# Altium project Documents.PrjPcb
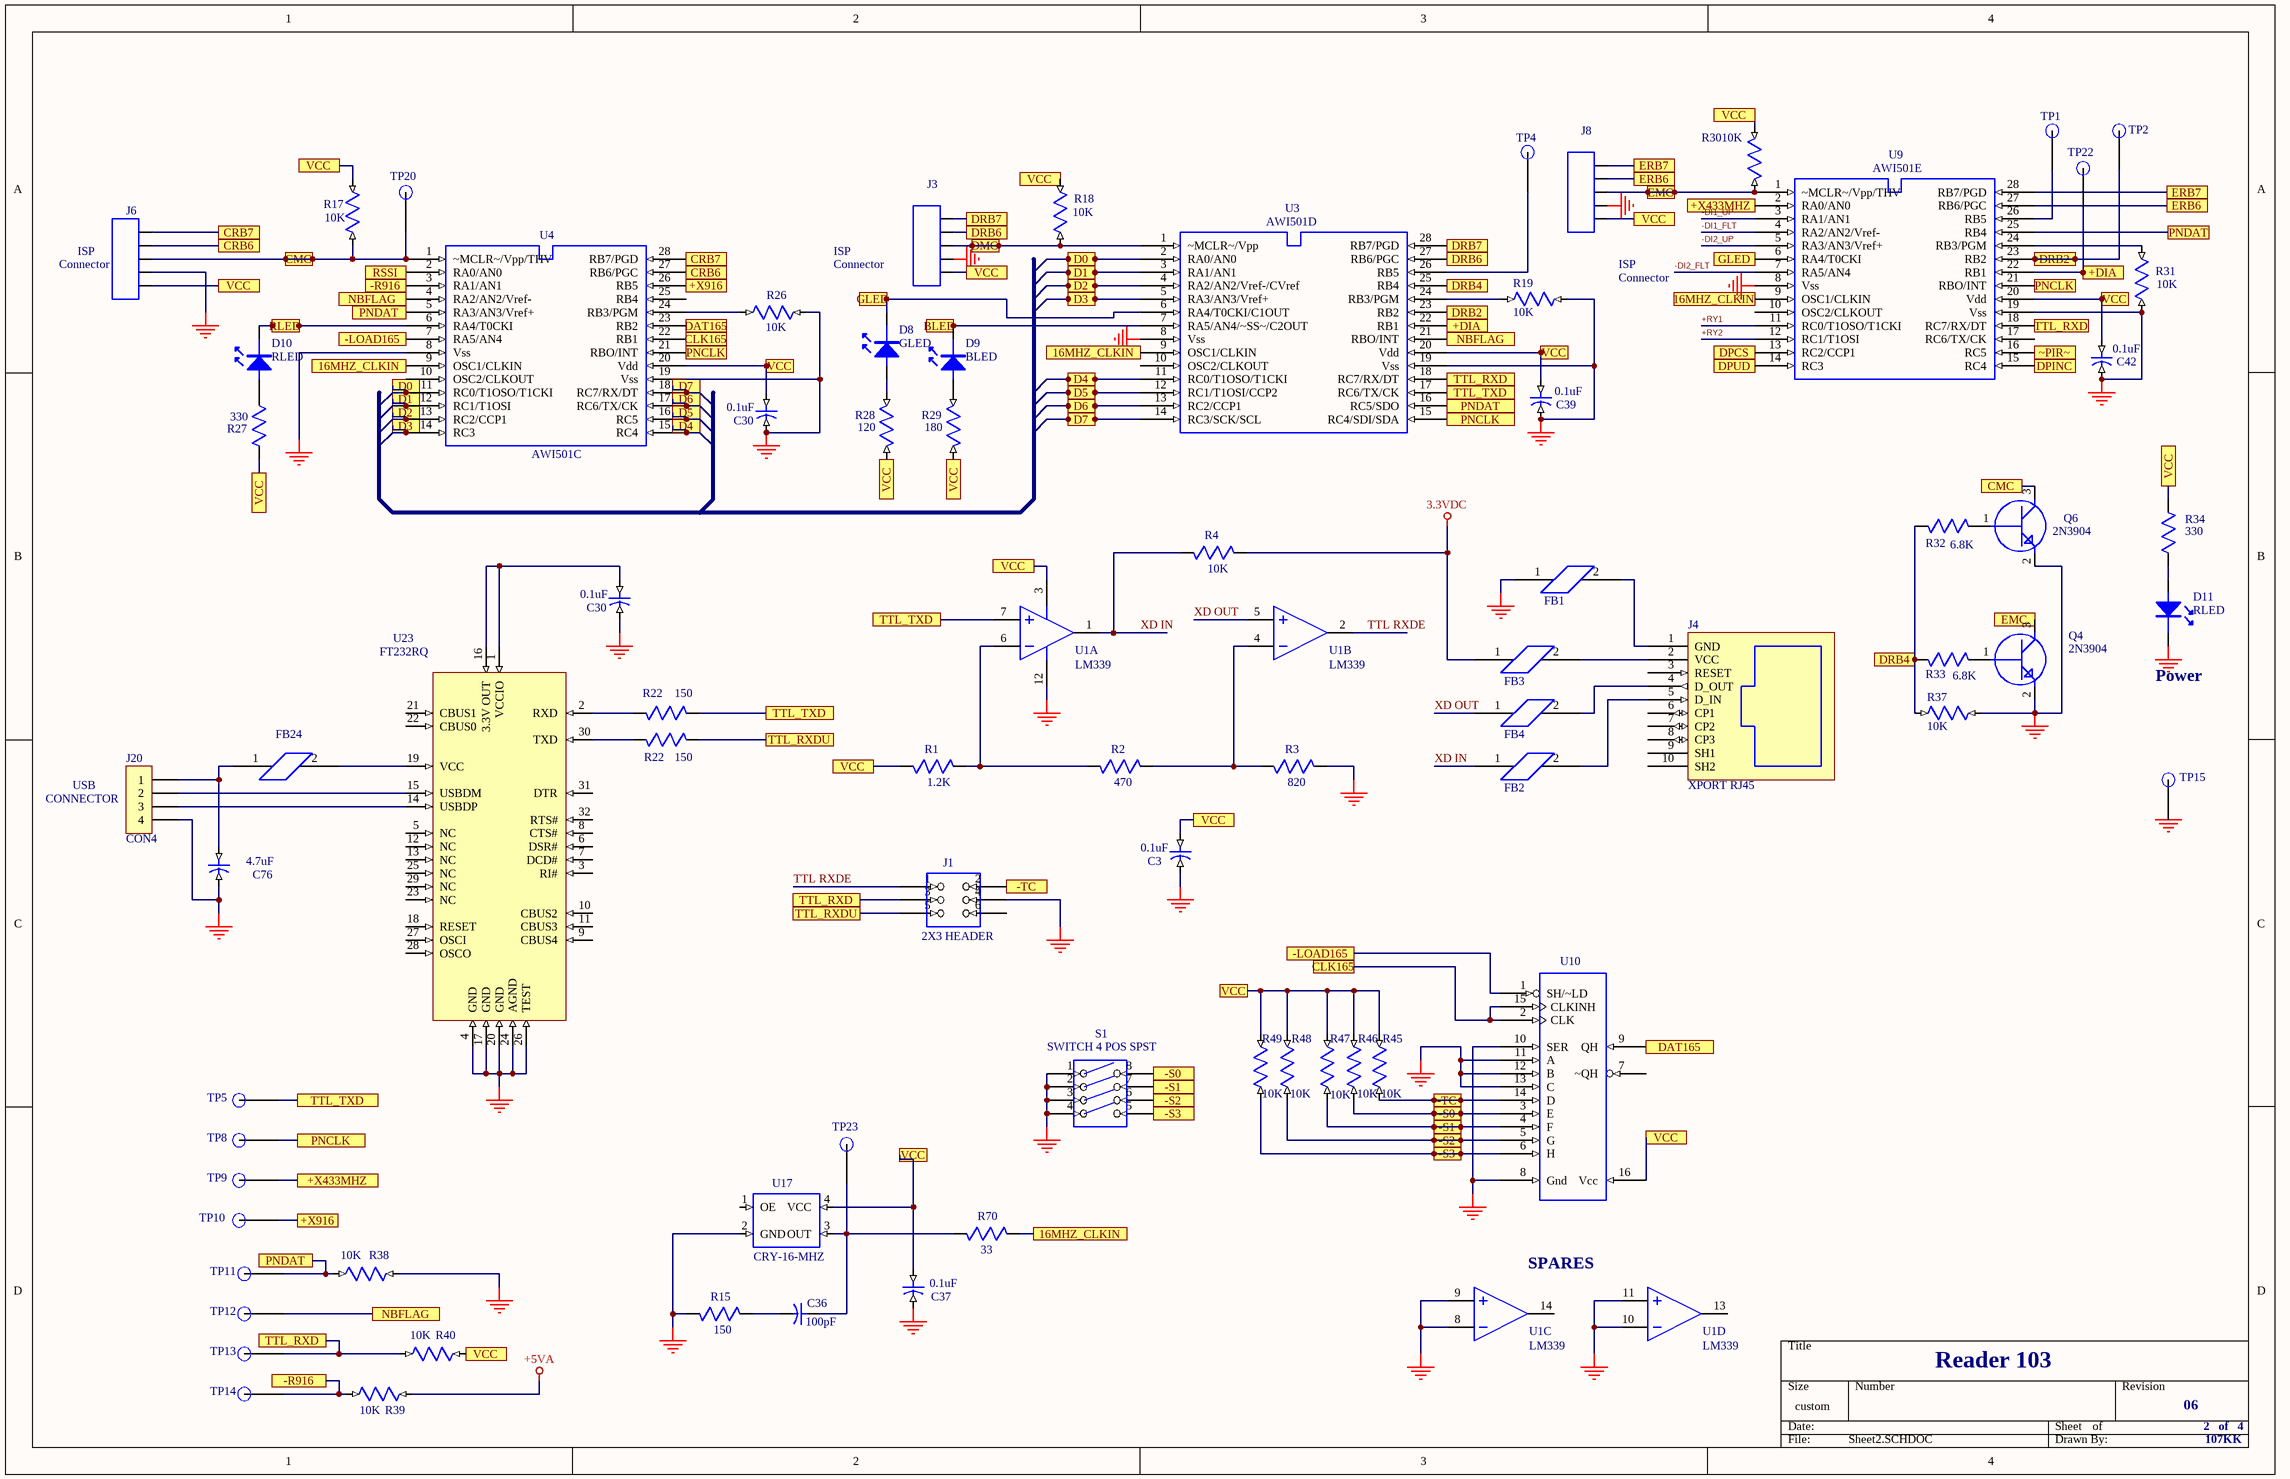
[diagram p0: Sheet2.SCHDOC]
2 sheets, 173 parts. Net scope: flat (ports and power ports of the same name join across sheets).
Sheets:
  Sheet2.SCHDOC
  Sheet3.SCHDOC

## Sheet Sheet2.SCHDOC
size 431 x 279 mm; SheetNumber: 0; SheetTotal: 0

### Parts
(Parts that share a designator on the sheet are numbered #1, #2 ... from top to bottom, then left to right.)
C3  0.1uF  [0603]
C30#1  0.1uF  [0603]
C30#2  0.1uF  [0603]
C36  100pF  [0603]
C37  0.1uF  [0603]
C39  0.1uF  [0603]
C42  0.1uF  [0603]
C76  4.7uF  [0603]
D8  GLED  [LED TH]
D9  BLED  [LED TH]
D10  RLED  [LED TH]
D11  RLED  [LED TH]
FB1  FB  [0603]  (value not drawn)
FB2  FB  [0603]  (value not drawn)
FB3  FB  [0603]  (value not drawn)
FB4  FB  [0603]  (value not drawn)
FB24  FB  [0603]  (value not drawn)
J1  2X3 HEADER  [2X3 HEADER]
J3  HDR5  [1X5 HEADER]  (value not drawn)
J4  XPORT RJ45  [CONN XPORT]
J6  HDR5  [1X5 HEADER]  (value not drawn)
J8  1X5 HEADER  [1X5 HEADER]  (value not drawn)
J20  CON4  [USB JACK]
Q4  2N3904  [SOT23 TRANS]
Q6  2N3904  [SOT23 TRANS]
R1  1.2K  [0603]
R2  470  [0603]
R3  820  [0603]
R4  10K  [0603]
R15  150  [0603]
R17  10K  [0603]
R18  10K  [0603]
R19  10K  [0603]
R22#1  150  [0603]
R22#2  150  [0603]
R26  10K  [0603]
R27  330  [0603]
R28  120  [0603]
R29  180  [0603]
R30  10K  [0603]
R31  10K  [0603]
R32  6.8K  [0603]
R33  6.8K  [0603]
R34  330  [0603]
R37  10K  [0603]
R38  10K  [0603]
R39  10K  [0603]
R40  10K  [0603]
R45  10K  [0603]
R46  10K  [0603]
R47  10K  [0603]
R48  10K  [0603]
R49  10K  [0603]
R70  33  [0603]
S1  SWITCH 4 POS SPST  [SWITCH 4 POS SPST]
TP1  TP  [TESTPOINT-1]  (value not drawn)
TP2  TP  [TESTPOINT-1]  (value not drawn)
TP4  TP  [TESTPOINT-1]  (value not drawn)
TP5  TP  [TESTPOINT-1]  (value not drawn)
TP8  TP  [TESTPOINT-1]  (value not drawn)
TP9  TP  [TESTPOINT-1]  (value not drawn)
TP10  TP  [TESTPOINT-1]  (value not drawn)
TP11  TP  [TESTPOINT-1]  (value not drawn)
TP12  TP  [TESTPOINT-1]  (value not drawn)
TP13  TP  [TESTPOINT-1]  (value not drawn)
TP14  TP  [TESTPOINT-1]  (value not drawn)
TP15  TP  [TESTPOINT-1]  (value not drawn)
TP20  TP  [TESTPOINT-1]  (value not drawn)
TP22  TP  [TESTPOINT-1]  (value not drawn)
TP23  TP  [TESTPOINT-1]  (value not drawn)
U1  LM339  [SO14]  (parts A,B,C,D of 4)
U3  AWI501D  [SSOP-28]
U4  AWI501C  [PIC16F870]
U9  AWI501E  [PIC16F870]
U10  74165  [SO16]  (value not drawn)
U17  CRY-16-MHZ  [CRY-SMD-5-7]
U23  FT232RQ  [QFN32]

### Ports
16MHZ_CLKIN, +DIA, +X433MHZ, +X916, -LOAD165, -R916, -S0, -S1, -S2, -S3, -TC, BLED, CLK165, CMC, CRB6, CRB7, D0, D1, D2, D3, D4, D5, D6, D7, DAT165, DMC, DPCS, DPINC, DPUD, DRB2, DRB4, DRB6, DRB7, EMC, ERB6, ERB7, GLED, NBFLAG, PNCLK, PNDAT, RLED, RSSI, TTL_RXD, TTL_RXDU, TTL_TXD, VCC, ~PIR~

### Nets
3.3VDC: FB3.1 R4.1(A)
+5VA: R39.1(A)
GND_COM: C3.2(B) C30#1.2(B) C30#2.2(B) C37.2(B) C39.2(B) C42.2(B) C76.2(B) D11.K FB1.1 J1.4 J3.4 J6.4 J8.4 J20.4 Q4.2 Q6.2 R3.1(A) R15.2(B) R19.1(A) R26.2(B) R31.2(B) R37.2(B) R38.1(A) S1.1 S1.2 S1.3 S1.4 TP15.1(TP) U1.8 U1.9 U1.10 U1.11 U1.12 U3.8(Vss) U3.19(Vss) U4.8(Vss) U4.19(Vss) U9.8(Vss) U9.19(Vss) U10.8(Gnd) U10.10(SER) U10.11(A) U10.12(B) U10.13(C) U17.2(GND) U23.4(GND) U23.17(GND) U23.20(GND) U23.24(AGND) U23.26(TEST)
+RY1: U9.11(RC0/T1OSO/T1CKI)
+RY2: U9.12(RC1/T1OSI)
-DI1_FLT: U9.4(RA2/AN2/Vref-)
-DI1_UP: U9.3(RA1/AN1)
-DI2_FLT: U9.7(RA5/AN4)
-DI2_UP: U9.5(RA3/AN3/Vref+)
SOUT: R39.2(B) TP14.1(TP) U4.3(RA1/AN1) ; port -R916
TTL RXDE: J1.1 U1.2
XD IN: FB2.1 R4.2(B) U1.1
XD OUT: FB4.1 U1.5
NetC3_1: C3.1(A) C30#1.1(A) C37.1(A) C39.1(A) C42.1(A) J3.5 J6.5 J8.5 R1.2(B) R17.1(A) R18.1(A) R27.1(A) R28.1(A) R29.1(A) R30.1(A) R34.2(B) R40.1(A) R45.2(B) R46.2(B) R47.2(B) R48.2(B) R49.2(B) U1.3 U3.20(Vdd) U4.20(Vdd) U9.20(Vdd) U10.16(Vcc) U17.4(VCC) ; port VCC
NetC30#2_1: C30#2.1(A) U23.1(VCCIO) U23.16(3.3V_OUT)
NetC36_1: C36.1(A) R70.2(B) TP23.1(TP) U17.3(OUT)
NetC36_2: C36.2(B) R15.1(A)
NetC40_1: U9.13(RC2/CCP1) ; port DPCS
NetC43_1: TP9.1(TP) U9.2(RA0/AN0) ; port +X433MHZ
NetC45_1: TP10.1(TP) U4.26(RB5) ; port +X916
NetC47_1: U4.2(RA0/AN0) ; port RSSI
NetC50_1: U9.14(RC3) ; port DPUD
NetC51_1: U9.15(RC4) ; port DPINC
NetC76_1: C76.1(A) FB24.1 J20.1
NetD3_A: U9.16(RC5) ; port ~PIR~
NetD8_A: D8.A R28.2(B)
NetD8_K: D8.K U3.6(RA4/T0CKI/C1OUT) U9.6(RA4/T0CKI) ; port GLED
NetD9_A: D9.A R29.2(B)
NetD9_K: D9.K U3.7(RA5/AN4/~SS~/C2OUT) ; port BLED
NetD10_A: D10.A R27.2(B)
NetD10_K: D10.K U4.6(RA4/T0CKI) ; port RLED
NetD11_A: D11.A R34.1(A)
NetFB1_2: FB1.2 J4.1(GND)
NetFB2_2: FB2.2 J4.5(D_IN)
NetFB3_2: FB3.2 J4.2(VCC)
NetFB4_2: FB4.2 J4.4(D_OUT)
NetFB24_2: FB24.2 U23.19(VCC)
NetJ1_2: J1.2 R45.1(A) U10.14(D) ; port -TC
NetJ1_3: J1.3 R40.2(B) TP13.1(TP) U3.18(RC7/RX/DT) U9.18(RC7/RX/DT) ; port TTL_RXD
NetJ1_5: J1.5 R22#2.1(A) ; port TTL_RXDU
NetJ3_1: J3.1 U3.28(RB7/PGD) ; port DRB7
NetJ3_2: J3.2 U3.27(RB6/PGC) ; port DRB6
NetJ3_3: J3.3 R18.2(B) U3.1(~MCLR~/Vpp) ; port DMC
NetJ6_1: J6.1 U4.28(RB7/PGD) ; port CRB7
NetJ6_2: J6.2 U4.27(RB6/PGC) ; port CRB6
NetJ6_3: J6.3 Q6.3 R17.2(B) TP20.1(TP) U4.1(~MCLR~/Vpp/THV) ; port CMC
NetJ8_1: J8.1 U9.28(RB7/PGD) ; port ERB7
NetJ8_2: J8.2 U9.27(RB6/PGC) ; port ERB6
NetJ8_3: J8.3 Q4.3 R30.2(B) U9.1(~MCLR~/Vpp/THV) ; port EMC
NetJ20_2: J20.2 U23.15(USBDM)
NetJ20_3: J20.3 U23.14(USBDP)
NetQ4_1: Q4.1 R33.2(B)
NetQ6_1: Q6.1 R32.2(B)
NetR1_1: R1.1(A) R2.2(B) U1.6
NetR2_1: R2.1(A) R3.2(B) U1.4
NetR19_2: R19.2(B) U3.24(RB3/PGM)
NetR22#1_1: R22#1.1(A) TP5.1(TP) U1.7 U3.17(RC6/TX/CK) ; port TTL_TXD
NetR22#1_2: R22#1.2(B) U23.2(RXD)
NetR22#2_2: R22#2.2(B) U23.30(TXD)
NetR26_1: R26.1(A) U4.24(RB3/PGM)
NetR31_1: R31.1(A) U9.24(RB3/PGM)
NetR32_1: R32.1(A) R33.1(A) R37.1(A) U3.25(RB4) ; port DRB4
NetR38_2: R38.2(B) TP11.1(TP) U3.16(RC5/SDO) U4.5(RA3/AN3/Vref+) U9.25(RB4) ; port PNDAT
NetR46_1: R46.1(A) S1.8 U10.3(E) ; port -S0
NetR47_1: R47.1(A) S1.7 U10.4(F) ; port -S1
NetR48_1: R48.1(A) S1.6 U10.5(G) ; port -S2
NetR49_1: R49.1(A) S1.5 U10.6(H) ; port -S3
NetR70_1: R70.1(A) U3.9(OSC1/CLKIN) U4.9(OSC1/CLKIN) U9.9(OSC1/CLKIN) ; port 16MHZ_CLKIN
NetTP1_1: TP1.1(TP) U9.26(RB5)
NetTP2_1: TP2.1(TP) U3.23(RB2) U9.23(RB2) ; port DRB2
NetTP4_1: TP4.1(TP) U3.26(RB5)
NetTP8_1: TP8.1(TP) U3.15(RC4/SDI/SDA) U4.21(RBO/INT) U9.21(RBO/INT) ; port PNCLK
NetTP12_1: TP12.1(TP) U3.21(RBO/INT) U4.4(RA2/AN2/Vref-) ; port NBFLAG
NetTP22_1: TP22.1(TP) U3.22(RB1) U9.22(RB1) ; port +DIA
NetU3_2: U3.2(RA0/AN0) U4.11(RC0/T1OSO/T1CKI) ; port D0
NetU3_3: U3.3(RA1/AN1) U4.12(RC1/T1OSI) ; port D1
NetU3_4: U3.4(RA2/AN2/Vref-/CVref) U4.13(RC2/CCP1) ; port D2
NetU3_5: U3.5(RA3/AN3/Vref+) U4.14(RC3) ; port D3
NetU3_11: U3.11(RC0/T1OSO/T1CKI) U4.15(RC4) ; port D4
NetU3_12: U3.12(RC1/T1OSI/CCP2) U4.16(RC5) ; port D5
NetU3_13: U3.13(RC2/CCP1) U4.17(RC6/TX/CK) ; port D6
NetU3_14: U3.14(RC3/SCK/SCL) U4.18(RC7/RX/DT) ; port D7
NetU4_7: U4.7(RA5/AN4) U10.1(SH/~LD) ; port -LOAD165
NetU4_22: U4.22(RB1) U10.2(CLK) U10.15(CLKINH) ; port CLK165
NetU4_23: U4.23(RB2) U10.9(QH) ; port DAT165

Not connected (* = marked no-connect by the designer): J1 6; J4 3(RESET) 6(CP1) 7(CP2) 8(CP3) 9(SH1) 10(SH2); U1 13 14; U3 10(OSC2/CLKOUT); U4 10(OSC2/CLKOUT) 25(RB4); U9 10(OSC2/CLKOUT) 17(RC6/TX/CK); U10 7(~QH); U17 1(OE); U23 3(RI#) 5(NC) 6(DSR#) 7(DCD#) 8(CTS#) 9(CBUS4) 10(CBUS2) 11(CBUS3) 12(NC) 13(NC) 18(RESET) 21(CBUS1) 22(CBUS0) 23(NC) 25(NC) 27(OSCI) 28(OSCO) 29(NC) 31(DTR) 32(RTS#)

### Notes on the sheet
- (near J6) Connector
- (near J6) ISP
- ISP
- Connector
- (near D11) Power
- (near J20) CONNECTOR
- USB
- (near U1) SPARES
- Reader 103
- 06
- 2   of   4
- 107KK

### Library data of the parts
C3 C30#1 C30#2 C37 C39 C42 C76 = C_603: Part Field 1: Part Number ECJ-1VF1H104Z; Part Field 2: Vendor Panasonic - ECG; Part Field 3: Description CAP .1UF 50V CERAMIC Y5V 0603
C36 = C_0603: Part Field 1: Part Number ECJ-1VC1H101J; Part Field 2: Vendor Panasonic - ECG; Part Field 3: Description CAP CERAMIC 100PF 50V 0603 SMD
D8-D11 = LED
FB1-FB4 FB24 = FB_0603: Part Field 1: Part Number EXC-ML16A270U; Part Field 2: Vendor Panasonic - ECG; Part Field 3: Description BEAD CORE 27 OHM 4A 0603 SMD
J1 = HDR3X2: Part Field 1: Part Number PTC03DAAN
J4 = XPORT
J8 = HDR5
J20 = CON4: Connector
Q4 Q6 = XSTR_NPN_SOT23: Part Field 1: Part Number FMMT3904TA; Part Field 2: Vendor Zetex Inc.; Part Field 3: Description TRANS GP NPN 40V 200MA SOT-23
R1-R4 R15 R22#1 R22#2 R70 = R_0603: Part Field 1: Part Number 9C06031A1500JLHFT; Part Field 2: Vendor Yageo America; Part Field 3: Description RES 150 OHM 1/16W 5% 0603 SMD
R17-R19 R26 R30 R31 R37-R40 = R_603: Part Field 1: Part Number ERA-V15J103V; Part Field 2: Vendor Panasonic - ECG; Part Field 3: Description RES 10K OHM 1/16W 1500PPM 5%0603
R27 = R_0603: Part Field 1: Part Number ERJ-3GEYJ331V; Part Field 2: Vendor Panasonic - ECG; Part Field 3: Description RES 330 OHM 1/10W 5% 0603 SMD
R28 = R0402: Part Field 1: Part Number ERJ-3GEYJ121V; Part Field 2: Vendor Panasonic - ECG; Part Field 3: Description RES 120 OHM 1/10W 5% 0603 SMD
R29 = R0402: Part Field 1: Part Number ERJ-3GEYJ181V; Part Field 2: Vendor Panasonic - ECG; Part Field 3: Description RES 180 OHM 1/10W 5% 0603 SMD
R32-R34 = R_0603: Part Field 1: Part Number ERJ-3GEYJ682V; Part Field 2: Vendor Panasonic - ECG; Part Field 3: Description RES 6.8K OHM 1/10W 5% 0603 SMD
R45-R49 = R_603: Part Field 1: Part Number ERJ-3GEYJ121V; Part Field 2: Vendor Panasonic - ECG; Part Field 3: Description RES 120 OHM 1/10W 5% 0603 SMD
S1 = SW_4PIN_SMT
TP1 TP2 TP4 TP5 TP8-TP15 TP20 TP22 TP23 = TESTPOINT_1
U1 = OPAMP: Operational Amplifier
U3 = PIC16F876A: Part Field 1: Part Number PIC16F876A-E/SO; Part Field 2: Vendor Microchip Technology; Part Field 3: Description IC MCU FLASH 8KX14 W/AD 28-SOIC
U4 U9 = PIC16F870: Part Field 1: Part Number PIC16F870-E/SO; Part Field 2: Vendor Microchip Technology; Part Field 3: Description IC MCU CMOS 20MHZ 2K FLSH 28SOIC
U10 = 74165-SO-16
U17 = CRY-SMD-5-7
U23 = USB FT232RQ

## Sheet Sheet3.SCHDOC
size 431 x 279 mm; SheetNumber: 0; SheetTotal: 0
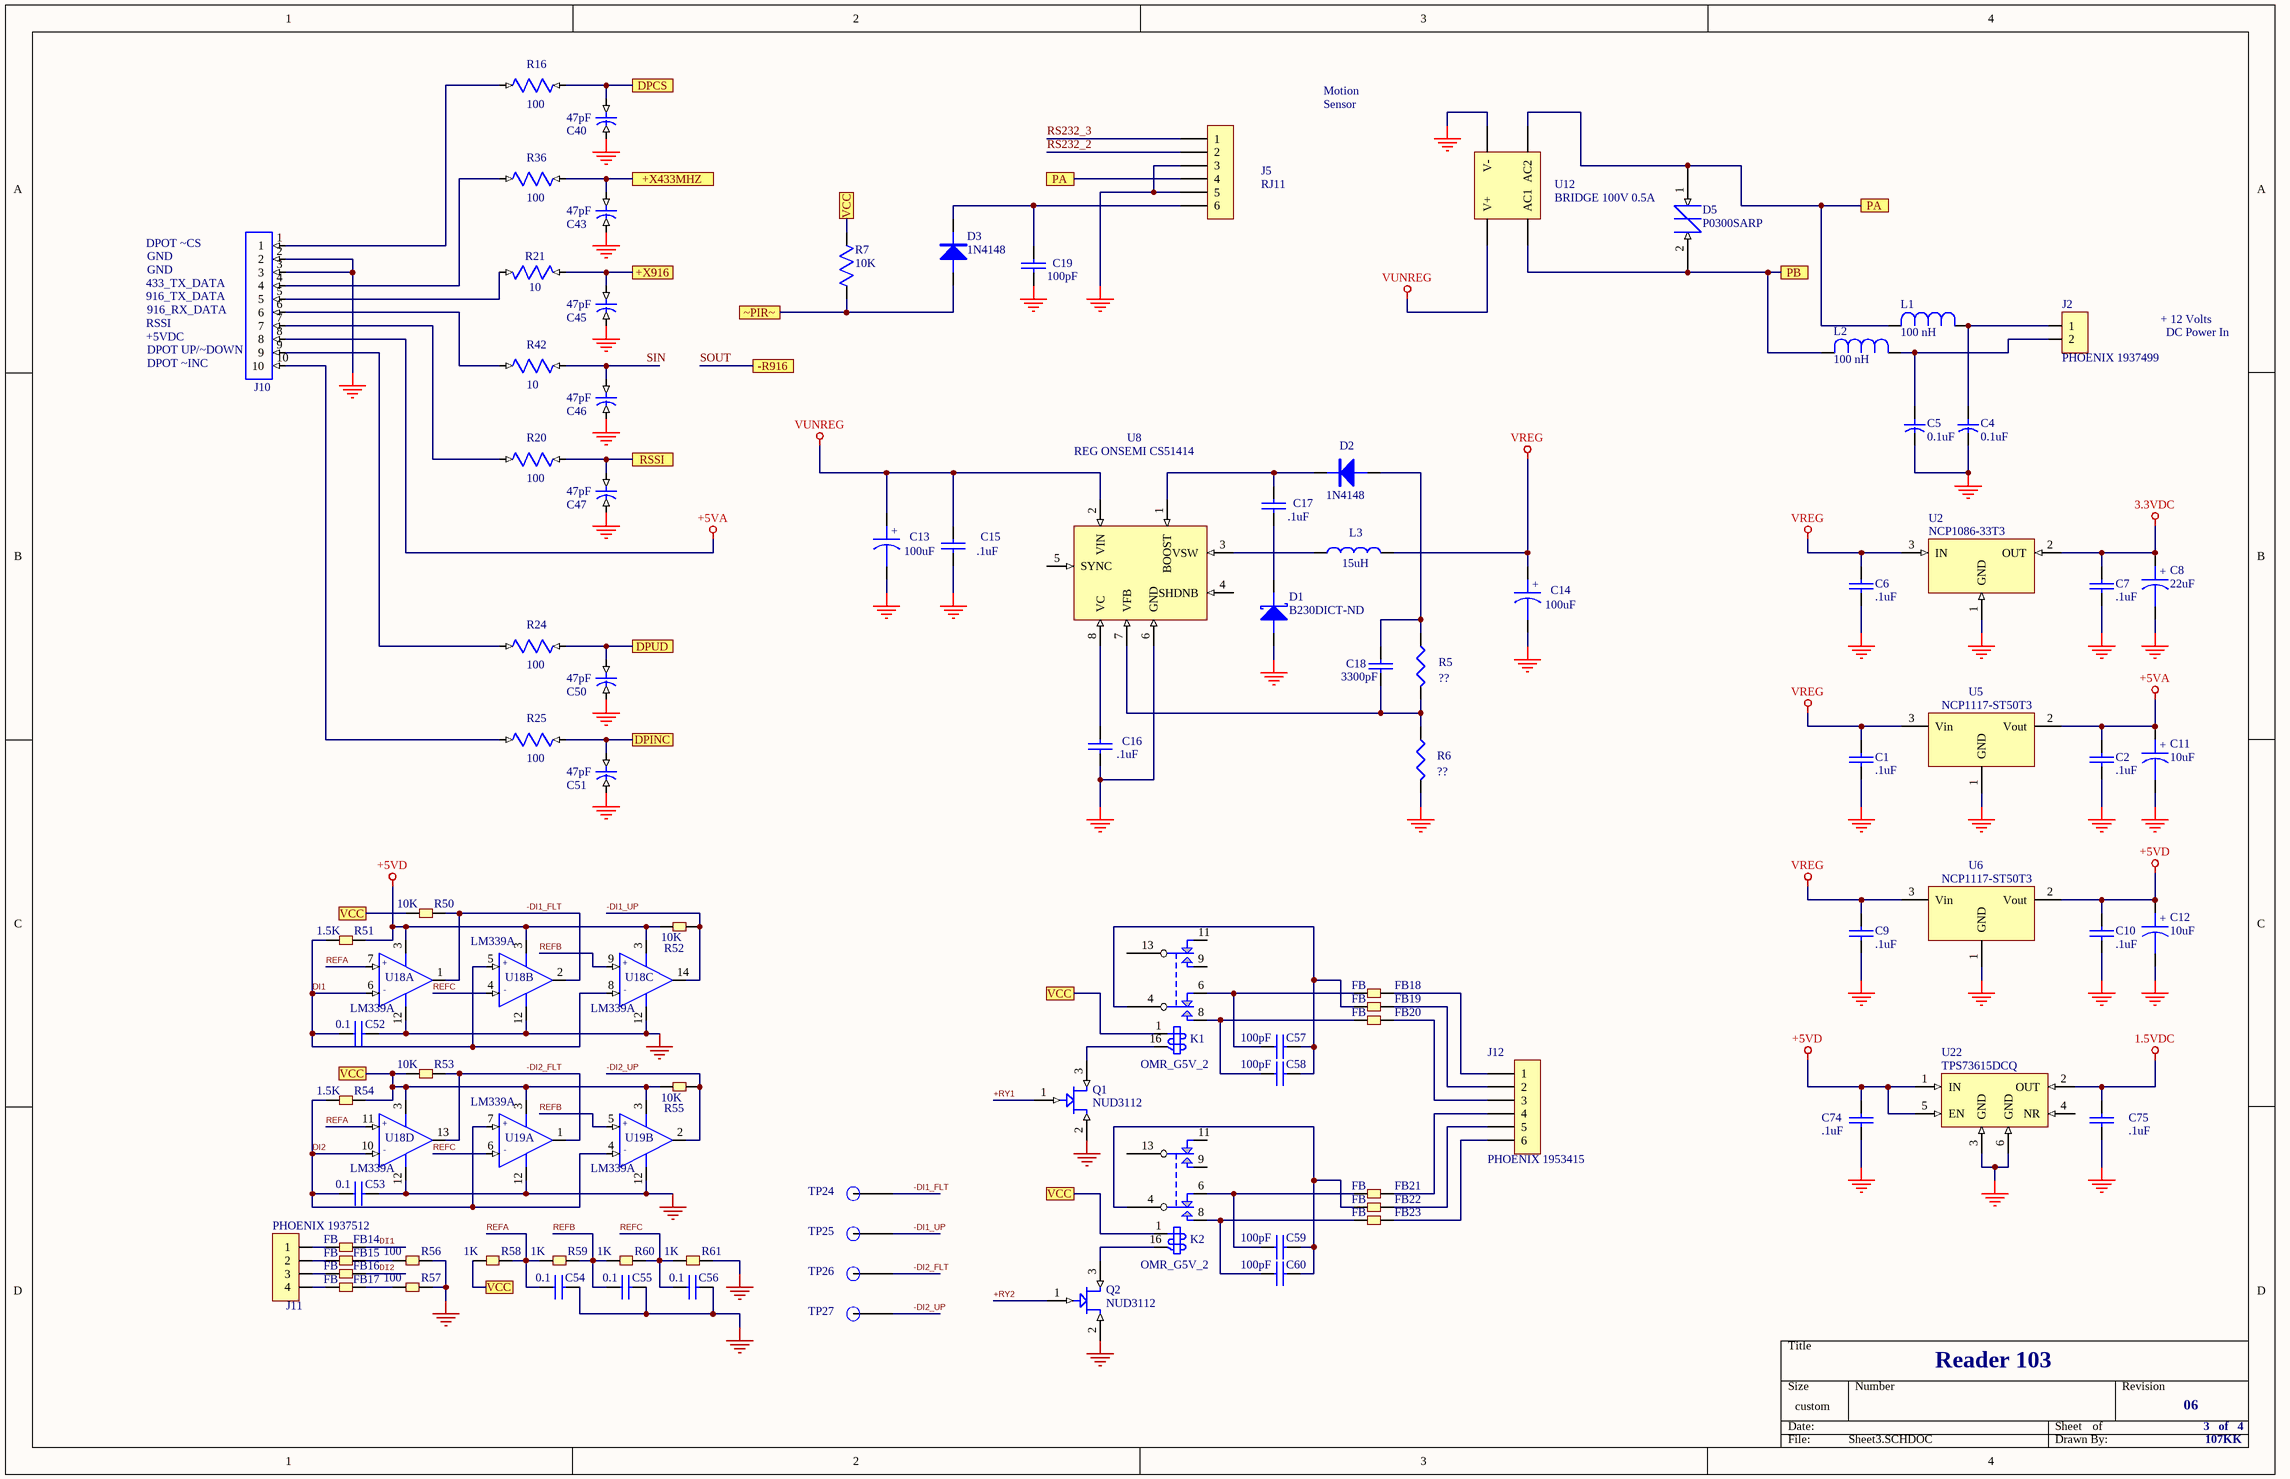
[diagram p1: Sheet3.SCHDOC]

### Parts
C1  .1uF  [0603]
C2  .1uF  [0603]
C4  0.1uF  [0603]
C5  0.1uF  [0603]
C6  .1uF  [0603]
C7  .1uF  [0603]
C8  22uF  [CAP A CASE]
C9  .1uF  [0603]
C10  .1uF  [0603]
C11  10uF  [CAP A CASE]
C12  10uF  [CAP A CASE]
C13  100uF  [CAP D CASE]
C14  100uF  [CAP D CASE]
C15  .1uF  [0603]
C16  .1uF  [0603]
C17  .1uF  [0603]
C18  3300pF  [0603]
C19  100pF  [0603]
C40  47pF  [C0603]
C43  47pF  [C0603]
C45  47pF  [C0603]
C46  47pF  [C0603]
C47  47pF  [C0603]
C50  47pF  [C0603]
C51  47pF  [C0603]
C52  0.1  [0805]
C53  0.1  [0805]
C54  0.1  [0805]
C55  0.1  [0805]
C56  0.1  [0805]
C57  100pF  [SM/C_0805]
C58  100pF  [SM/C_0805]
C59  100pF  [SM/C_0805]
C60  100pF  [SM/C_0805]
C74  .1uF  [0603]
C75  .1uF  [0603]
D1  B230DICT-ND  [DIODE SMB]
D2  1N4148  [SOD123]
D3  1N4148  [SOD123]
D5  P0300SARP  [TRANSORB_1]
FB14  FB  [0603]
FB15  FB  [0603]
FB16  FB  [0603]
FB17  FB  [0603]
FB18  FB  [SM/R_1206]
FB19  FB  [SM/R_1206]
FB20  FB  [SM/R_1206]
FB21  FB  [SM/R_1206]
FB22  FB  [SM/R_1206]
FB23  FB  [SM/R_1206]
J2  PHOENIX 1937499  [CONN PHOENIX 1803227-2]
J5  RJ11  [RJ11]
J10  1X10 HEADER  [1X10 HEADER]  (value not drawn)
J11  PHOENIX 1937512  [CONN PHOENIX 1803293-4]
J12  PHOENIX 1953415  [CONN PHOENIX 1953211-6]
K1  OMR_G5V_2  [RELAY44]
K2  OMR_G5V_2  [RELAY44]
L1  100 nH  [0603]
L2  100 nH  [0603]
L3  15uH  [COIL COILTRONICS UP2B-150]
Q1  NUD3112  [SOT23]
Q2  NUD3112  [SOT23]
R5  ??  [0603]
R6  ??  [0603]
R7  10K  [0603]
R16  100  [R0603]
R20  100  [R0603]
R21  10  [R-603]
R24  100  [R0603]
R25  100  [R0603]
R36  100  [R0603]
R42  10  [R0603]
R50  10K  [0805]
R51  1.5K  [0805]
R52  10K  [0805]
R53  10K  [0805]
R54  1.5K  [0805]
R55  10K  [0805]
R56  100  [0805]
R57  100  [0805]
R58  1K  [0805]
R59  1K  [0805]
R60  1K  [0805]
R61  1K  [0805]
TP24  TP  [TESTPOINT-1]  (value not drawn)
TP25  TP  [TESTPOINT-1]  (value not drawn)
TP26  TP  [TESTPOINT-1]  (value not drawn)
TP27  TP  [TESTPOINT-1]  (value not drawn)
U2  NCP1086-33T3  [SOT223 REG GOI]
U5  NCP1117-ST50T3  [SOT223 REG]
U6  NCP1117-ST50T3  [SOT223 REG]
U8  REG ONSEMI CS51414  [SO8]
U12  BRIDGE 100V 0.5A  [BRIDGE]
U18  LM339A  [SO14]  (parts A,B,C,D of 4)
U19  LM339A  [SO14]  (parts A,B of 4)
U22  TPS73615DCQ  [SOT223-5]

### Ports
+X433MHZ, +X916, -R916, DPCS, DPINC, DPUD, PA, PB, RSSI, VCC, ~PIR~

### Nets
1.5VDC: C75.1 U22.2(OUT)
3.3VDC: C7.1 C8.1 U2.2(OUT)
+5VA: C2.1 C11.1 J10.8 U5.2(Vout)
+5VD: C10.1 C12.1 C74.1 R51.1 R52.2 U6.2(Vout) U18.3(V+) U22.1(IN) U22.5(EN)
GND_COM: C1.2 C2.2 C4.2(B) C5.2(B) C6.2 C7.2 C8.2 C9.2 C10.2 C11.2 C12.2 C13.2 C14.2 C15.2 C16.2 C19.2 C40.2(B) C43.2(B) C45.2(B) C46.2(B) C47.2(B) C50.2(B) C51.2(B) C52.2 C53.2 C54.2 C55.2 C56.2 C74.2 C75.2 D1.A J5.3 J5.5 J10.2 J10.3 Q1.2(S) Q2.2(S) R6.2 R56.1 R57.1 R61.1 U2.1(GND) U5.1(GND) U6.1(GND) U8.6(GND) U12.V- U18.12(V-) U19.12(V-) U22.3(GND) U22.6(GND)
VREG: C1.1 C6.1 C9.1 C14.1 L3.2 U2.3(IN) U5.3(Vin) U6.3(Vin)
VUNREG: C13.1 C15.1 U8.2(VIN) U12.V+
+RY1: Q1.1(G)
+RY2: Q2.1(G)
-DI1_FLT: R50.1 TP24.1(TP) U18.1(OUT) U18.2(OUT)
-DI1_UP: R52.1 TP25.1(TP) U18.14(OUT)
-DI2_FLT: R53.1 TP26.1(TP) U18.13(OUT) U19.1(OUT)
-DI2_UP: R55.1 TP27.1(TP) U19.2(OUT)
DI1: C52.1 FB14.1 R51.2 U18.5(+) U18.6(-) U18.8(-)
DI2: C53.1 FB16.1 R54.2 U18.10(-) U19.4(-) U19.7(+)
REFA: C54.1 R58.1 R59.2 U18.7(+) U18.11(+)
REFB: C55.1 R59.1 R60.2 U18.9(+) U19.5(+)
REFC: C56.1 R60.1 R61.2 U18.4(-) U19.6(-)
RS232_2: J5.2
RS232_3: J5.1
SIN: C46.1(A) R42.2(B)
NetC3_1: K1.1(COIL1) K2.1(COIL1) R7.1(A) R50.2 R53.2 R54.1 R55.2 R58.2 U18.3(V+) U19.3(V+) ; port VCC
NetC4_1: C4.1(A) J2.1 L1.2(A)
NetC5_1: C5.1(A) J2.2 L2.2(A)
NetC16_1: C16.1 U8.8(VC)
NetC17_1: C17.1 D2.K U8.1(BOOST)
NetC17_2: C17.2 D1.K
NetC18_1: C18.1 D2.A R5.1
NetC18_2: C18.2 R5.2 R6.1 U8.7(VFB)
NetC19_1: C19.1 D3.K J5.6
NetC40_1: C40.1(A) R16.2(B) ; port DPCS
NetC43_1: C43.1(A) R36.2(B) ; port +X433MHZ
NetC45_1: C45.1(A) R21.1(A) ; port +X916
NetC47_1: C47.1(A) R20.2(B) ; port RSSI
NetC50_1: C50.1(A) R24.2(B) ; port DPUD
NetC51_1: C51.1(A) R25.2(B) ; port DPINC
NetC57_1: C57.1 FB18.2 K1.6(NC2)
NetC57_2: C57.2 C58.2 FB19.2 K1.4(COMMON2)
NetC58_1: C58.1 FB20.2 K1.8(NO2)
NetC59_1: C59.1 FB21.2 K2.6(NC2)
NetC59_2: C59.2 C60.2 FB22.2 K2.4(COMMON2)
NetC60_1: C60.1 FB23.2 K2.8(NO2)
NetD3_A: D3.A R7.2(B) ; port ~PIR~
NetD5_1: D5.1 J5.4 L1.1(B) U12.AC2 ; port PA
NetD5_2: D5.2 L2.1(B) U12.AC1 ; port PB
NetFB14_2: FB14.2 J11.1
NetFB15_1: FB15.1 R56.2
NetFB15_2: FB15.2 J11.2
NetFB16_2: FB16.2 J11.3
NetFB17_1: FB17.1 R57.2
NetFB17_2: FB17.2 J11.4
NetFB18_1: FB18.1 J12.1
NetFB19_1: FB19.1 J12.2
NetFB20_1: FB20.1 J12.3
NetFB21_1: FB21.1 J12.4
NetFB22_1: FB22.1 J12.5
NetFB23_1: FB23.1 J12.6
NetJ10_1: J10.1 R16.1(A)
NetJ10_4: J10.4 R36.1(A)
NetJ10_5: J10.5 R21.2(B)
NetJ10_6: J10.6 R42.1(A)
NetJ10_7: J10.7 R20.1(A)
NetJ10_9: J10.9 R24.1(A)
NetJ10_10: J10.10 R25.1(A)
NetK1_16: K1.16(COIL2) Q1.3(D)
NetK2_16: K2.16(COIL2) Q2.3(D)
NetL3_1: L3.1 U8.3(VSW)

Not connected (* = marked no-connect by the designer): K1 9(NO1) 11(NC1) 13(COMMON1); K2 9(NO1) 11(NC1) 13(COMMON1); U8 4(SHDNB) 5(SYNC); U22 4(NR)

### Notes on the sheet
- Motion
- Sensor
- DPOT ~CS
- 916_TX_DATA
- 433_TX_DATA
- GND
- +5VDC
- RSSI
- DPOT ~INC
- (near J10) DPOT UP/~DOWN
- 916_RX_DATA
- + 12 Volts
- DC Power In
- Reader 103
- 06
- 3   of   4
- 107KK
- (in symbol CAPACITOR POL) +

### Library data of the parts
C1 C2 C6 C7 C9 C10 C15-C19 C74 C75 = CAP: Capacitor
C4 C5 = C_0603: Part Field 1: Description CAP .10UF 25V CERAMIC Y5V 0603; Part Field 2: Vendor Kemet; Part Field 3: Part Number C0603C104Z3VACTU
C8 C11-C14 = CAPACITOR POL: Capacitor
C40 C43 C45-C47 C50 C51 = C0603: Part Field 1: Part Number 0603N470J500NT; Part Field 2: Vendor BC Components; Part Field 3: Description Cap, Ceramic, 47pF, 50V, NP0, 0603, SMD
C52-C60 = CAP NP_1: Text Field1: 20; Text Field2: 10
D1 = DIODE SCHOTTKY: Schottky Diode
D2 D3 = DIODE
D5 = TRANSORB
FB14-FB23 = FB: Text Field1: 10; Text Field2: 20
J2 = CON2: Connector
J5 J12 = CON6: Connector
J10 = HDR10
J11 = CON4: Text Field1: 20; Text Field2: 50
K1 K2 = OMRON_G5V_3: Text Field1: 20; Text Field2: 100
L1 L2 = INDUCTOR_1: Part Field 1: Part Number ELJ-RER10JF3; Part Field 2: Vendor Panasonic - ECG; Part Field 3: Description INDUCTOR 100NH 5% FIXED SMD
L3 = INDUCTOR1
Q1 Q2 = INDUCTIVE LOAD DRIVER
R5 R6 = RES1
R7 = R_0603: Part Field 1: Part Number ERA-V15J103V; Part Field 2: Vendor Panasonic - ECG; Part Field 3: Description RES 10K OHM 1/16W 1500PPM 5%0603
R16 R20 R24 R25 R36 R42 = R0603: Part Field 1: Part Number 9C06031A1000JLHFT; Part Field 2: Vendor Yageo America; Part Field 3: Description RES, 100 OHM, 1/10W, 5%, 0603, SMD
R21 = R_603: Part Field 1: Part Number 9C06031A10R0FKHFT; Part Field 2: Vendor Yageo America; Part Field 3: Description RES, 10, OHM, 1/16W, 5%, 0603, SMD
R50-R61 = RS: Text Field1: 10; Text Field2: 20
TP24-TP27 = TESTPOINT_1
U2 = REG GOI
U5 U6 = REG REVERSED
U12 = BRIDGE2: Diode Bridge
U18 U19 = LM339: Text Field1: 40; Text Field2: 40
U22 = REG SOT223-5

## Nets that join several sheets
3.3VDC: Sheet2 (FB3.1 R4.1), Sheet3 (C7.1 C8.1 U2.2)
+5VA: Sheet2 (R39.1), Sheet3 (C2.1 C11.1 J10.8 U5.2)
GND_COM: Sheet2 (50 pins), Sheet3 (50 pins)
NetC3_1: Sheet2 (28 pins), Sheet3 (10 pins)
NetC40_1: Sheet2 (U9.13), Sheet3 (C40.1 R16.2)
NetC43_1: Sheet2 (TP9.1 U9.2), Sheet3 (C43.1 R36.2)
NetC45_1: Sheet2 (TP10.1 U4.26), Sheet3 (C45.1 R21.1)
NetC47_1: Sheet2 (U4.2), Sheet3 (C47.1 R20.2)
NetC50_1: Sheet2 (U9.14), Sheet3 (C50.1 R24.2)
NetC51_1: Sheet2 (U9.15), Sheet3 (C51.1 R25.2)
NetD3_A: Sheet2 (U9.16), Sheet3 (D3.A R7.2)